# Altium project BoDieuKhienSoXuLyAmThanh.PrjPcb
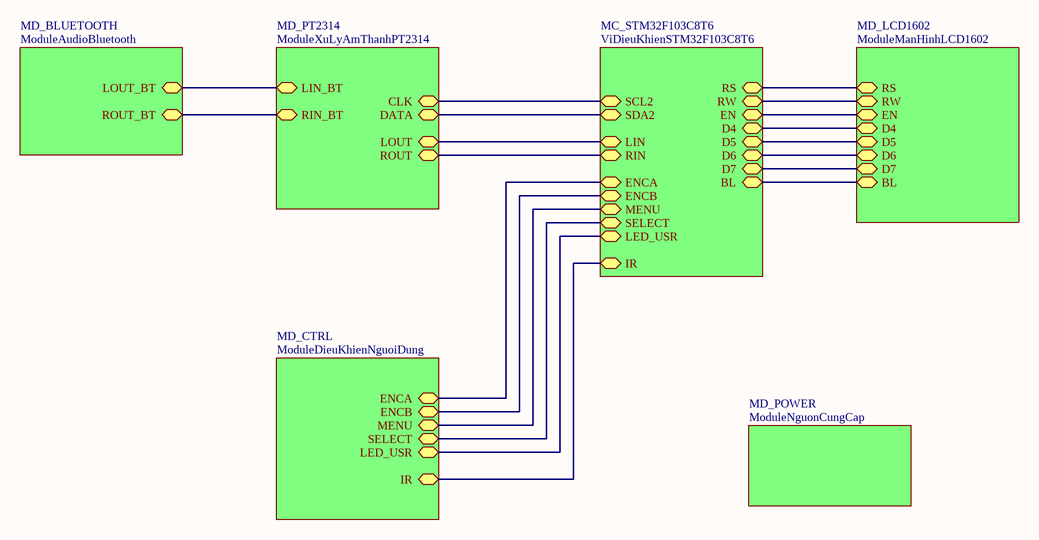
[diagram p0: BoDieuKhienSoXuLyAmThanh.SchDoc]
7 sheets, 100 parts. Net scope: hierarchical (ports join the sheet entries above them; power ports are global).
Board file: BoDieuKhienSoXuLyAmThanh.PcbDoc
Sheets:
  BoDieuKhienSoXuLyAmThanh.SchDoc
    MD_PT2314 = ModuleXuLyAmThanhPT2314.SchDoc
    MC_STM32F103C8T6 = ViDieuKhienSTM32F103C8T6.SchDoc
    MD_LCD1602 = ModuleManHinhLCD1602.SchDoc
    MD_POWER = ModuleNguonCungCap.SchDoc
    MD_CTRL = ModuleDieuKhienNguoiDung.SchDoc
    MD_BLUETOOTH = ModuleAudioBluetooth.SchDoc

## Sheet BoDieuKhienSoXuLyAmThanh.SchDoc
size A

### Sub-sheets
MC_STM32F103C8T6 = ViDieuKhienSTM32F103C8T6: RS (bidir), RW (bidir), EN (bidir), D4 (bidir), D5 (bidir), D6 (bidir), D7 (bidir), BL (bidir), IR (bidir), SCL2 (bidir), SDA2 (bidir), ENCA (bidir), ENCB (bidir), MENU (bidir), SELECT (bidir), LIN (bidir), RIN (bidir), LED_USR (bidir)
MD_BLUETOOTH = ModuleAudioBluetooth: LOUT_BT (bidir), ROUT_BT (bidir)
MD_CTRL = ModuleDieuKhienNguoiDung: ENCA (bidir), ENCB (bidir), MENU (bidir), SELECT (bidir), IR (bidir), LED_USR (bidir)
MD_LCD1602 = ModuleManHinhLCD1602: RS (bidir), RW (bidir), EN (bidir), D4 (bidir), D5 (bidir), D6 (bidir), D7 (bidir), BL (bidir)
MD_POWER = ModuleNguonCungCap: no entries
MD_PT2314 = ModuleXuLyAmThanhPT2314: LOUT (bidir), ROUT (bidir), DATA (bidir), CLK (bidir), LIN_BT (bidir), RIN_BT (bidir)

### Nets
LOUT: sheet MD_PT2314/LOUT, sheet MC_STM32F103C8T6/LIN
PA3: sheet MC_STM32F103C8T6/LED_USR, sheet MD_CTRL/LED_USR
PA12: sheet MC_STM32F103C8T6/BL, sheet MD_LCD1602/BL
ROUT: sheet MD_PT2314/ROUT, sheet MC_STM32F103C8T6/RIN
NetC18_1: sheet MD_PT2314/LIN_BT, sheet MD_BLUETOOTH/LOUT_BT
NetC20_1: sheet MD_PT2314/RIN_BT, sheet MD_BLUETOOTH/ROUT_BT
NetC32_1: sheet MC_STM32F103C8T6/ENCA, sheet MD_CTRL/ENCA
NetC33_1: sheet MC_STM32F103C8T6/ENCB, sheet MD_CTRL/ENCB
NetC34_1: sheet MC_STM32F103C8T6/SELECT, sheet MD_CTRL/SELECT
NetC35_1: sheet MC_STM32F103C8T6/MENU, sheet MD_CTRL/MENU
NetHR1_1: sheet MC_STM32F103C8T6/IR, sheet MD_CTRL/IR
NetMD2_4: sheet MC_STM32F103C8T6/RS, sheet MD_LCD1602/RS
NetMD2_5: sheet MC_STM32F103C8T6/RW, sheet MD_LCD1602/RW
NetMD2_6: sheet MC_STM32F103C8T6/EN, sheet MD_LCD1602/EN
NetMD2_11: sheet MC_STM32F103C8T6/D4, sheet MD_LCD1602/D4
NetMD2_12: sheet MC_STM32F103C8T6/D5, sheet MD_LCD1602/D5
NetMD2_13: sheet MC_STM32F103C8T6/D6, sheet MD_LCD1602/D6
NetMD2_14: sheet MC_STM32F103C8T6/D7, sheet MD_LCD1602/D7
NetR12_1: sheet MD_PT2314/CLK, sheet MC_STM32F103C8T6/SCL2
NetR13_1: sheet MD_PT2314/DATA, sheet MC_STM32F103C8T6/SDA2

## Sheet ModuleXuLyAmThanhPT2314.SchDoc
size A
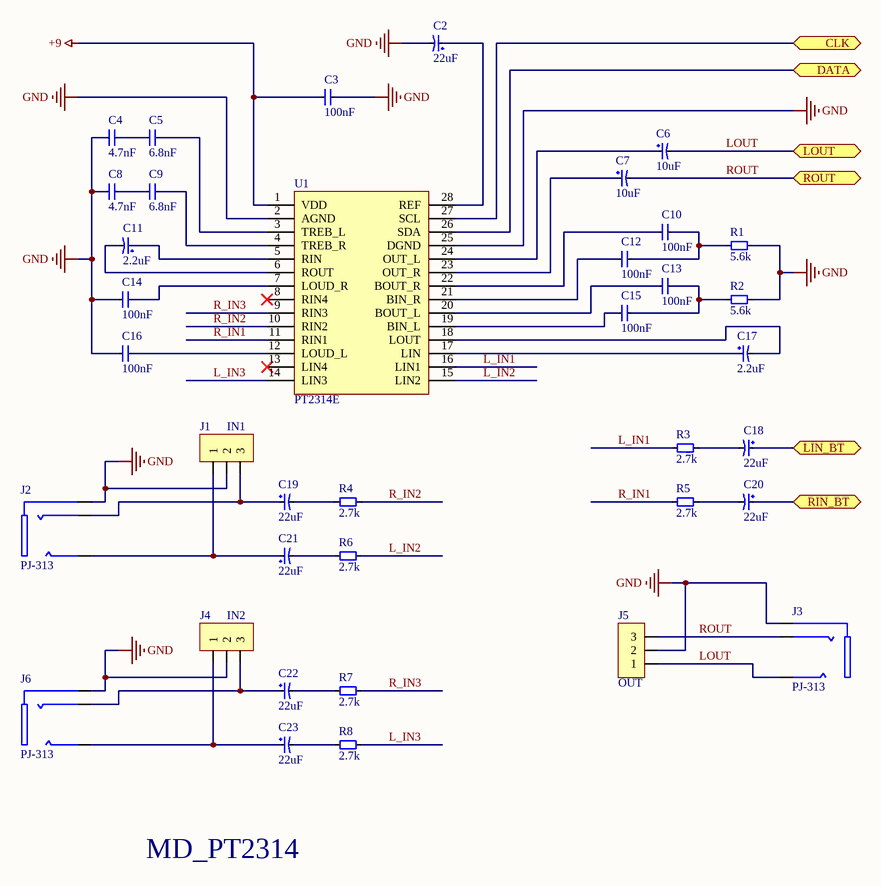
[diagram p1: ModuleXuLyAmThanhPT2314.SchDoc]

### Parts
C2  22uF  [C-ELE-1.5-4X7MM]
C3  100nF  [C-0805]
C4  4.7nF  [C-0805]
C5  6.8nF  [C-0805]
C6  10uF  [C-ELE-1.5-4X7MM]
C7  10uF  [C-ELE-1.5-4X7MM]
C8  4.7nF  [C-0805]
C9  6.8nF  [C-0805]
C10  100nF  [C-0805]
C11  2.2uF  [C-ELE-1.5-4X7MM]
C12  100nF  [C-0805]
C13  100nF  [C-0805]
C14  100nF  [C-0805]
C15  100nF  [C-0805]
C16  100nF  [C-0805]
C17  2.2uF  [C-ELE-1.5-4X7MM]
C18  22uF  [C-ELE-1.5-4X7MM]
C19  22uF  [C-ELE-1.5-4X7MM]
C20  22uF  [C-ELE-1.5-4X7MM]
C21  22uF  [C-ELE-1.5-4X7MM]
C22  22uF  [C-ELE-1.5-4X7MM]
C23  22uF  [C-ELE-1.5-4X7MM]
J1  IN1  [XH1X3M-2.54]
J2  PJ-313  [PJ-313]
J3  PJ-313  [PJ-313]
J4  IN2  [XH1X3M-2.54]
J5  OUT  [XH1X3M-2.54]
J6  PJ-313  [PJ-313]
R1  5.6k  [R-0805]
R2  5.6k  [R-0805]
R3  2.7k  [R-0805]
R4  2.7k  [R-0805]
R5  2.7k  [R-0805]
R6  2.7k  [R-0805]
R7  2.7k  [R-0805]
R8  2.7k  [R-0805]
U1  PT2314E  [SO28W-1.27-300MIL]

### Ports
CLK (bidir), DATA (bidir), LIN_BT (bidir), LOUT (bidir), RIN_BT (bidir), ROUT (bidir)

### Nets
+9: C3.1 U1.1(VDD)
GND: C2.2 C3.2 C4.1 C8.1 C14.1 C16.1 J1.2 J2.1 J3.1 J4.2 J5.2 J6.1 R1.2 R2.2 U1.2(AGND) U1.25(DGND)
L_IN1: R3.2 U1.16(LIN1)
L_IN2: R6.2 U1.15(LIN2)
L_IN3: R8.2 U1.14(LIN3)
LOUT: C6.2 J3.3 J5.1 ; port LOUT
R_IN1: R5.1 U1.11(RIN1)
R_IN2: R4.1 U1.10(RIN2)
R_IN3: R7.1 U1.9(RIN3)
ROUT: C7.2 J3.2 J5.3 ; port ROUT
NetC2_1: C2.1 U1.28(REF)
NetC4_2: C4.2 C5.1
NetC5_2: C5.2 U1.3(TREB_L)
NetC6_1: C6.1 U1.24(OUT_L)
NetC7_1: C7.1 U1.23(OUT_R)
NetC8_2: C8.2 C9.1
NetC9_2: C9.2 U1.4(TREB_R)
NetC10_1: C10.1 U1.22(BOUT_R)
NetC10_2: C10.2 C12.2 R1.1
NetC11_1: C11.1 U1.5(RIN)
NetC11_2: C11.2 U1.6(ROUT)
NetC12_1: C12.1 U1.21(BIN_R)
NetC13_1: C13.1 U1.20(BOUT_L)
NetC13_2: C13.2 C15.2 R2.1
NetC14_2: C14.2 U1.7(LOUD_R)
NetC15_1: C15.1 U1.19(BIN_L)
NetC16_2: C16.2 U1.12(LOUD_L)
NetC17_1: C17.1 U1.17(LIN)
NetC17_2: C17.2 U1.18(LOUT)
NetC18_1: C18.1 ; port LIN_BT
NetC18_2: C18.2 R3.1
NetC19_1: C19.1 J1.3 J2.2
NetC19_2: C19.2 R4.2
NetC20_1: C20.1 ; port RIN_BT
NetC20_2: C20.2 R5.2
NetC21_1: C21.1 J1.1 J2.3
NetC21_2: C21.2 R6.1
NetC22_1: C22.1 J4.3 J6.2
NetC22_2: C22.2 R7.2
NetC23_1: C23.1 J4.1 J6.3
NetC23_2: C23.2 R8.1
NetR12_1: U1.27(SCL) ; port CLK
NetR13_1: U1.26(SDA) ; port DATA

Not connected (* = marked no-connect by the designer): U1 8(RIN4)* 13(LIN4)*

### Notes on the sheet
- MD_PT2314

### Library data of the parts
C2 C6 C7 C11 C17-C23 = CAP-ELE: Cac Loai Tu Hoa
C3-C5 C8-C10 C12-C16 = CAP: Cac Loai Tu Khong Phan Cuc
J1 J4 J5 = XH1X3-2.54: Header 3 Chan XH 2.54mm
J2 J3 J6 = PJ-313: Jack Ket Noi Audio 3.5MM
R1-R8 = RES: Cac Loai Dien Tro
U1 = PT2314E: IC Xu Ly Am Thanh So

## Sheet ViDieuKhienSTM32F103C8T6.SchDoc
size A
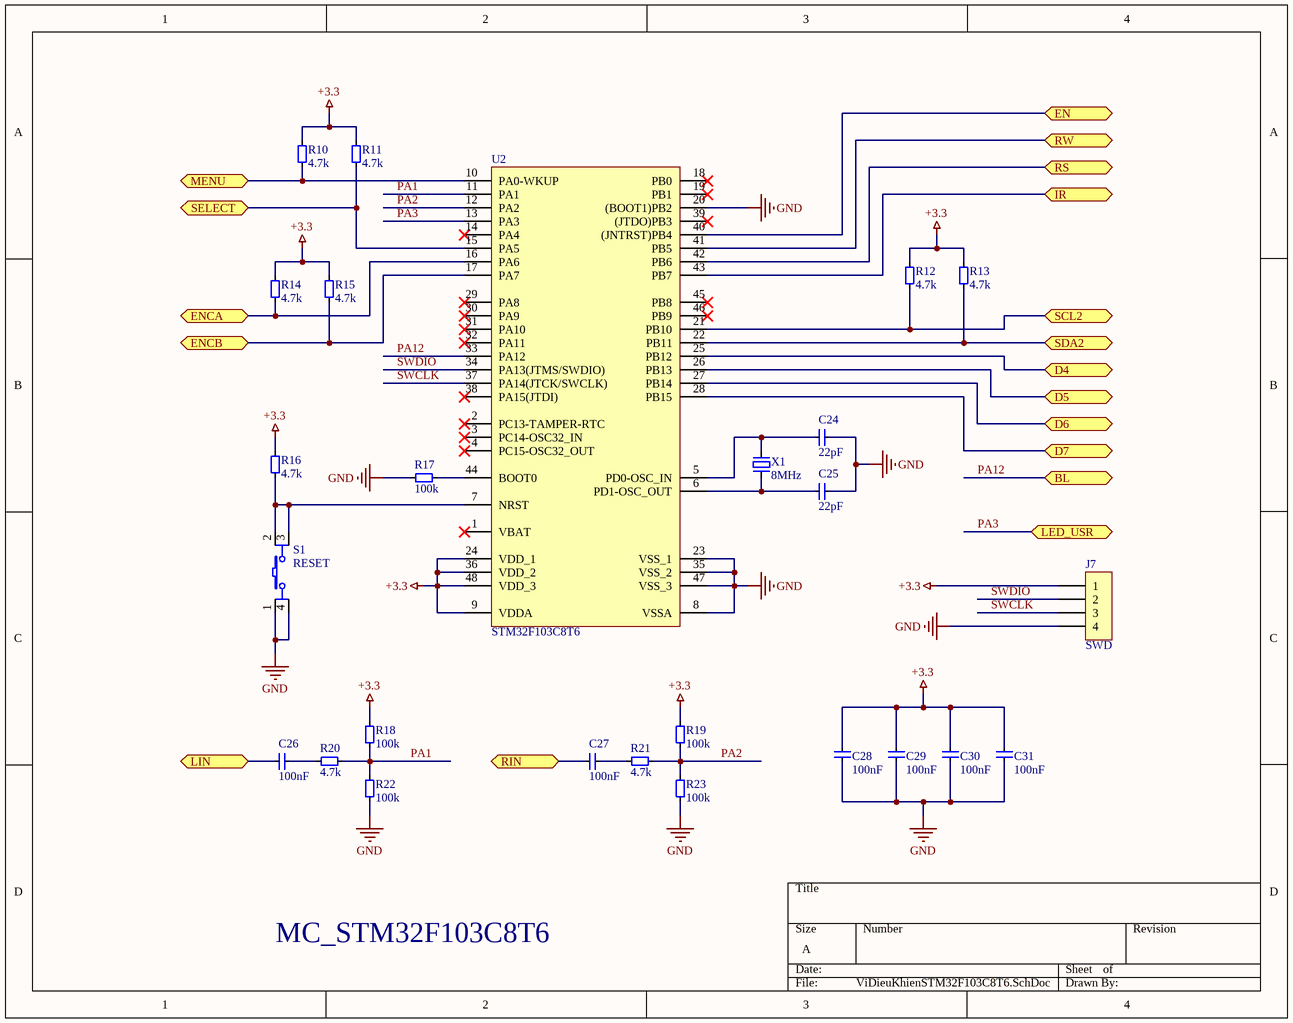
[diagram p2: ViDieuKhienSTM32F103C8T6.SchDoc]

### Parts
C24  22pF  [C-0805]
C25  22pF  [C-0805]
C26  100nF  [C-0805]
C27  100nF  [C-0805]
C28  100nF  [C-0805]
C29  100nF  [C-0805]
C30  100nF  [C-0805]
C31  100nF  [C-0805]
J7  SWD  [JP1X4M-2.54]
R10  4.7k  [R-0805]
R11  4.7k  [R-0805]
R12  4.7k  [R-0805]
R13  4.7k  [R-0805]
R14  4.7k  [R-0805]
R15  4.7k  [R-0805]
R16  4.7k  [R-0805]
R17  100k  [R-0805]
R18  100k  [R-0805]
R19  100k  [R-0805]
R20  4.7k  [R-0805]
R21  4.7k  [R-0805]
R22  100k  [R-0805]
R23  100k  [R-0805]
S1  RESET  [SW4P-DIP-6X6MM]
U2  STM32F103C8T6  [LQFP48-0.5-7X7MM]
X1  8MHz  [XTAL-HC49US]

### Ports
BL (bidir), D4 (bidir), D5 (bidir), D6 (bidir), D7 (bidir), EN (bidir), ENCA (bidir), ENCB (bidir), IR (bidir), LED_USR (bidir), LIN (bidir), MENU (bidir), RIN (bidir), RS (bidir), RW (bidir), SCL2 (bidir), SDA2 (bidir), SELECT (bidir)

### Nets
+3.3: C28.1 C29.1 C30.1 C31.1 J7.1 R10.2 R11.2 R12.2 R13.2 R14.2 R15.2 R16.2 R18.2 R19.2 U2.9(VDDA) U2.24(VDD_1) U2.36(VDD_2) U2.48(VDD_3)
GND: C24.1 C25.1 C28.2 C29.2 C30.2 C31.2 J7.4 R17.1 R22.1 R23.1 S1.1 S1.4 U2.8(VSSA) U2.20((BOOT1)PB2) U2.23(VSS_1) U2.35(VSS_2) U2.47(VSS_3)
LOUT: C26.2 ; port LIN
PA1: R18.1 R20.1 R22.2 U2.11(PA1)
PA2: R19.1 R21.1 R23.2 U2.12(PA2)
PA3: U2.13(PA3) ; port LED_USR
PA12: U2.33(PA12) ; port BL
ROUT: C27.2 ; port RIN
SWCLK: J7.3 U2.37(PA14(JTCK/SWCLK))
SWDIO: J7.2 U2.34(PA13(JTMS/SWDIO))
NetC24_2: C24.2 U2.5(PD0-OSC_IN) X1.1
NetC25_2: C25.2 U2.6(PD1-OSC_OUT) X1.2
NetC26_1: C26.1 R20.2
NetC27_1: C27.1 R21.2
NetC32_1: R14.1 U2.16(PA6) ; port ENCA
NetC33_1: R15.1 U2.17(PA7) ; port ENCB
NetC34_1: R11.1 U2.15(PA5) ; port SELECT
NetC35_1: R10.1 U2.10(PA0-WKUP) ; port MENU
NetHR1_1: U2.43(PB7) ; port IR
NetMD2_4: U2.42(PB6) ; port RS
NetMD2_5: U2.41(PB5) ; port RW
NetMD2_6: U2.40((JNTRST)PB4) ; port EN
NetMD2_11: U2.25(PB12) ; port D4
NetMD2_12: U2.26(PB13) ; port D5
NetMD2_13: U2.27(PB14) ; port D6
NetMD2_14: U2.28(PB15) ; port D7
NetR12_1: R12.1 U2.21(PB10) ; port SCL2
NetR13_1: R13.1 U2.22(PB11) ; port SDA2
NetR16_1: R16.1 S1.2 S1.3 U2.7(NRST)
NetR17_2: R17.2 U2.44(BOOT0)

Not connected (* = marked no-connect by the designer): U2 1(VBAT)* 2(PC13-TAMPER-RTC)* 3(PC14-OSC32_IN)* 4(PC15-OSC32_OUT)* 14(PA4)* 18(PB0)* 19(PB1)* 29(PA8)* 30(PA9)* 31(PA10)* 32(PA11)* 38(PA15(JTDI))* 39((JTDO)PB3)* 45(PB8)* 46(PB9)*

### Notes on the sheet
- MC_STM32F103C8T6

### Library data of the parts
C24-C31 = CAP: Cac Loai Tu Khong Phan Cuc
J7 = JP1X4-2.54: Jump Don 4 Chan 2.54mm
R10-R23 = RES: Cac Loai Dien Tro
S1 = SW4P-DIP-6X6MM: Nut Nhan 4 Chan 6X6MM
U2 = STM32F103C8T6: VDK 32-Bit ARM Cortex-M3
X1 = XTAL-HC49: Thach Anh 2 Chan HC49

## Sheet ModuleManHinhLCD1602.SchDoc
size A
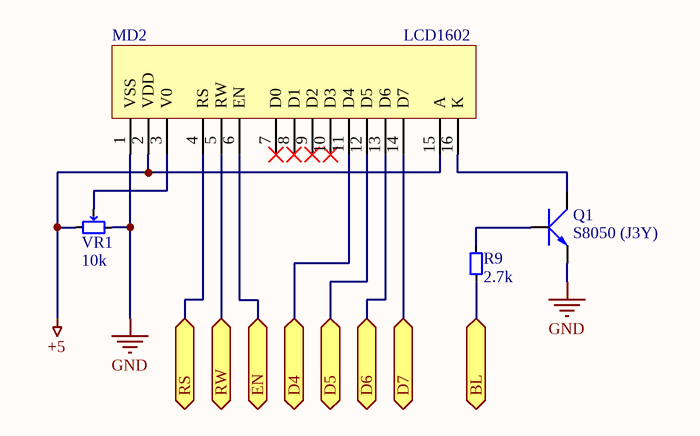
[diagram p3: ModuleManHinhLCD1602.SchDoc]

### Parts
MD2  LCD1602  [LCD1602-A]
Q1  S8050 (J3Y)  [SOT23]
R9  2.7k  [R-0805]
VR1  10k  [VR-ADJ-3362P]

### Ports
BL (bidir), D4 (bidir), D5 (bidir), D6 (bidir), D7 (bidir), EN (bidir), RS (bidir), RW (bidir)

### Nets
+5: MD2.2(VDD) MD2.15(A) VR1.3
GND: MD2.1(VSS) Q1.2(E) VR1.1
PA12: R9.1 ; port BL
NetMD2_3: MD2.3(V0) VR1.2
NetMD2_4: MD2.4(RS) ; port RS
NetMD2_5: MD2.5(RW) ; port RW
NetMD2_6: MD2.6(EN) ; port EN
NetMD2_11: MD2.11(D4) ; port D4
NetMD2_12: MD2.12(D5) ; port D5
NetMD2_13: MD2.13(D6) ; port D6
NetMD2_14: MD2.14(D7) ; port D7
NetMD2_16: MD2.16(K) Q1.3(C)
NetQ1_1: Q1.1(B) R9.2

Not connected (* = marked no-connect by the designer): MD2 7(D0)* 8(D1)* 9(D2)* 10(D3)*

### Library data of the parts
MD2 = LCD1602: Module Man Hinh LCD1602
Q1 = S8050 (J3Y): Transistor NPN 0.5A
R9 = RES: Cac Loai Dien Tro
VR1 = VRES: Cac Loai Bien Tro

## Sheet ModuleNguonCungCap.SchDoc
size A
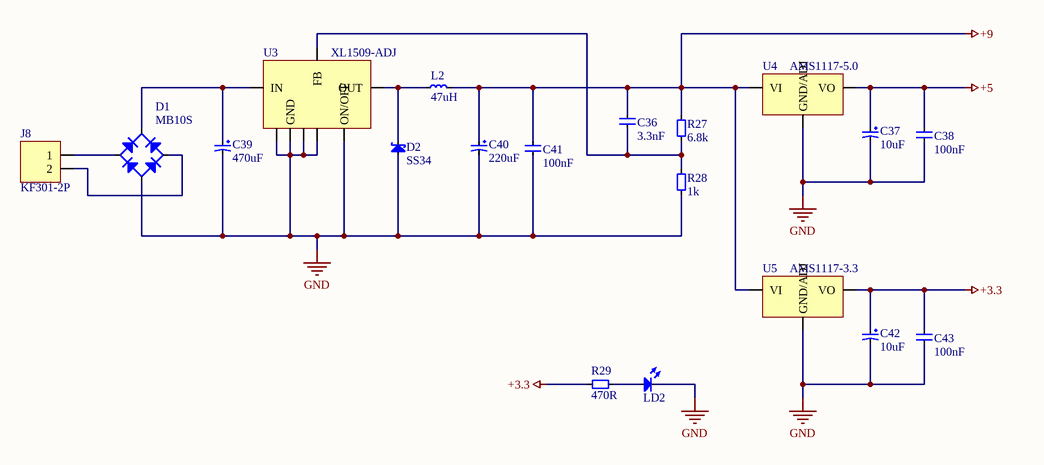
[diagram p4: ModuleNguonCungCap.SchDoc]

### Parts
C36  3.3nF  [C-0805]
C37  10uF  [C-ELE-1.5-4X7MM]
C38  100nF  [C-0805]
C39  470uF  [C-ELE-2.5-6.3X11MM]
C40  220uF  [C-ELE-2.5-6.3X11MM]
C41  100nF  [C-0805]
C42  10uF  [C-ELE-1.5-4X7MM]
C43  100nF  [C-0805]
D1  MB10S  [BRIDGE-MBS]
D2  SS34  [DO-214AC-SMA]
J8  KF301-2P  [KF301-2P-5.0]
L2  47uH  [L-PK0608-2.5-7X10MM]
LD2  PWR  [LED-0805-RED]  (value not drawn)
R27  6.8k  [R-0805]
R28  1k  [R-0805]
R29  470R  [R-0805]
U3  XL1509-ADJ  [SO8-1.27-150MIL]
U4  AMS1117-5.0  [SOT223]
U5  AMS1117-3.3  [SOT223]

### Nets
+3.3: C42.1 C43.2 R29.1 U5.2(VO)
+5: C37.1 C38.2 U4.2(VO)
+9: C36.2 C40.1 C41.2 L2.2 R27.2 U4.3(VI) U5.3(VI)
GND: C37.2 C38.1 C39.2 C40.2 C41.1 C42.2 C43.1 D1.DC- D2.1 LD2.2 R28.1 U3.4(ON/OFF) U3.5(GND) U3.6(GND) U3.7(GND) U3.8(GND) U4.1(GND/ADJ) U5.1(GND/ADJ)
NetC36_1: C36.1 R27.1 R28.2 U3.3(FB)
NetC39_1: C39.1 D1.DC+ U3.1(IN)
NetD1_AC1: D1.AC1 J8.1
NetD1_AC2: D1.AC2 J8.2
NetD2_2: D2.2 L2.1 U3.2(OUT)
NetLD2_1: LD2.1 R29.2

### Library data of the parts
C36 C38 C41 C43 = CAP: Cac Loai Tu Khong Phan Cuc
C37 C39 C40 C42 = CAP-ELE: Cac Loai Tu Hoa
D1 = BRIDGE: Cac Loai Diode Cau
D2 = SS34: Diode Schottky 1N5822 3A 40V Dan
J8 = KF301-2P: Dau Ket Noi KF301 2 Chan
L2 = IND: Cac Loai Cuon Cam Don
LD2 = LED: Cac Loai LED Don
R27-R29 = RES: Cac Loai Dien Tro
U3 = XL1509: IC On Ap Chuyen Mach 2A
U4 U5 = AMS1117: IC On Ap Tuyen Tinh AMS1117 1A

## Sheet ModuleDieuKhienNguoiDung.SchDoc
size A
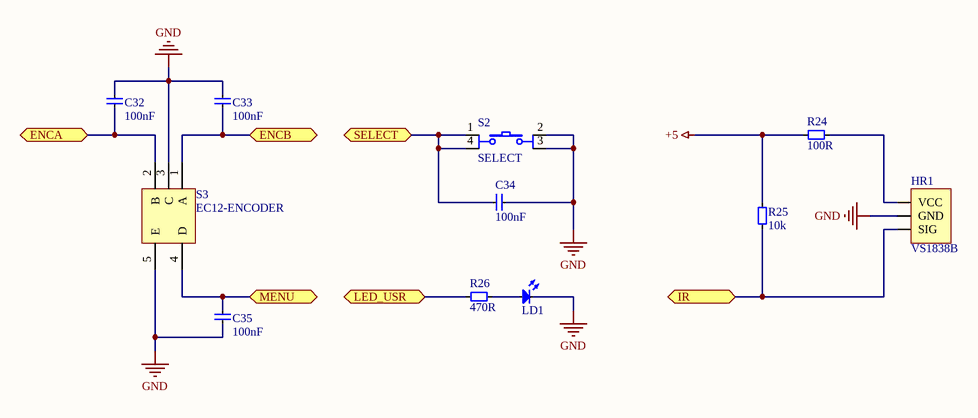
[diagram p5: ModuleDieuKhienNguoiDung.SchDoc]

### Parts
C32  100nF  [C-0805]
C33  100nF  [C-0805]
C34  100nF  [C-0805]
C35  100nF  [C-0805]
HR1  VS1838B  [VS1838B-A]
LD1  USR  [LED-0805-RED]  (value not drawn)
R24  100R  [R-0805]
R25  10k  [R-0805]
R26  470R  [R-0805]
S2  SELECT  [SW4P-DIP-6X6MM]
S3  EC12-ENCODER  [EC12-ENCODER]

### Ports
ENCA (bidir), ENCB (bidir), IR (bidir), LED_USR (bidir), MENU (bidir), SELECT (bidir)

### Nets
+5: R24.2 R25.2
GND: C32.2 C33.2 C34.2 C35.2 HR1.2(GND) LD1.2 S2.2 S2.3 S3.3(C) S3.5(E)
PA3: R26.1 ; port LED_USR
NetC32_1: C32.1 S3.2(B) ; port ENCA
NetC33_1: C33.1 S3.1(A) ; port ENCB
NetC34_1: C34.1 S2.1 S2.4 ; port SELECT
NetC35_1: C35.1 S3.4(D) ; port MENU
NetHR1_1: HR1.1(SIG) R25.1 ; port IR
NetHR1_3: HR1.3(VCC) R24.1
NetLD1_1: LD1.1 R26.2

### Library data of the parts
C32-C35 = CAP: Cac Loai Tu Khong Phan Cuc
HR1 = VS1838B: Module Giai Ma IR
LD1 = LED: Cac Loai LED Don
R24-R26 = RES: Cac Loai Dien Tro
S2 = SW4P-DIP-6X6MM: Nut Nhan 4 Chan 6X6MM
S3 = EC12-ENCODER: Encoder Xoay Vo Cap Co Nut Nhan

## Sheet ModuleAudioBluetooth.SchDoc
size A
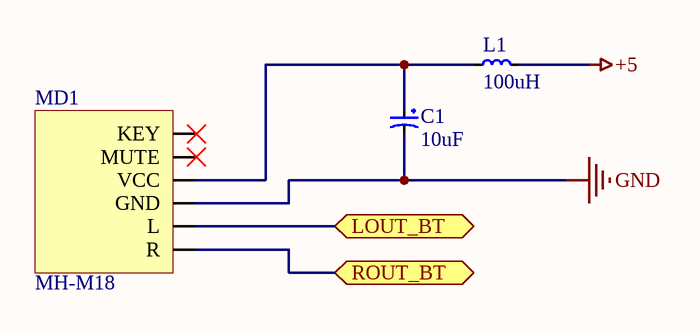
[diagram p6: ModuleAudioBluetooth.SchDoc]

### Parts
C1  10uF  [C-ELE-1.5-4X7MM]
L1  100uH  [L-PK0406-2-5X8MM]
MD1  MH-M18  [MH-M18]

### Ports
LOUT_BT (bidir), ROUT_BT (bidir)

### Nets
+5: L1.2
GND: C1.2 MD1.4(GND)
NetC1_1: C1.1 L1.1 MD1.3(VCC)
NetC18_1: MD1.5(L) ; port LOUT_BT
NetC20_1: MD1.6(R) ; port ROUT_BT

Not connected (* = marked no-connect by the designer): MD1 1(KEY)* 2(MUTE)*

### Library data of the parts
C1 = CAP-ELE: Cac Loai Tu Hoa
L1 = IND: Cac Loai Cuon Cam Don
MD1 = MH-M18: Module Thu Audio Bluetooth

## Nets that join several sheets
+3.3: ViDieuKhienSTM32F103C8T6 (18 pins), ModuleNguonCungCap (C42.1 C43.2 R29.1 U5.2)
+5: ModuleManHinhLCD1602 (MD2.2 MD2.15 VR1.3), ModuleNguonCungCap (C37.1 C38.2 U4.2), ModuleDieuKhienNguoiDung (R24.2 R25.2), ModuleAudioBluetooth (L1.2)
+9: ModuleXuLyAmThanhPT2314 (C3.1 U1.1), ModuleNguonCungCap (7 pins)
GND: ModuleXuLyAmThanhPT2314 (16 pins), ViDieuKhienSTM32F103C8T6 (17 pins), ModuleManHinhLCD1602 (MD2.1 Q1.2 VR1.1), ModuleNguonCungCap (18 pins), ModuleDieuKhienNguoiDung (10 pins), ModuleAudioBluetooth (C1.2 MD1.4)
LOUT: ModuleXuLyAmThanhPT2314 (C6.2 J3.3 J5.1), ViDieuKhienSTM32F103C8T6 (C26.2)
NetC18_1: ModuleXuLyAmThanhPT2314 (C18.1), ModuleAudioBluetooth (MD1.5)
NetC20_1: ModuleXuLyAmThanhPT2314 (C20.1), ModuleAudioBluetooth (MD1.6)
NetC32_1: ViDieuKhienSTM32F103C8T6 (R14.1 U2.16), ModuleDieuKhienNguoiDung (C32.1 S3.2)
NetC33_1: ViDieuKhienSTM32F103C8T6 (R15.1 U2.17), ModuleDieuKhienNguoiDung (C33.1 S3.1)
NetC34_1: ViDieuKhienSTM32F103C8T6 (R11.1 U2.15), ModuleDieuKhienNguoiDung (C34.1 S2.1 S2.4)
NetC35_1: ViDieuKhienSTM32F103C8T6 (R10.1 U2.10), ModuleDieuKhienNguoiDung (C35.1 S3.4)
NetHR1_1: ViDieuKhienSTM32F103C8T6 (U2.43), ModuleDieuKhienNguoiDung (HR1.1 R25.1)
NetMD2_4: ViDieuKhienSTM32F103C8T6 (U2.42), ModuleManHinhLCD1602 (MD2.4)
NetMD2_5: ViDieuKhienSTM32F103C8T6 (U2.41), ModuleManHinhLCD1602 (MD2.5)
NetMD2_6: ViDieuKhienSTM32F103C8T6 (U2.40), ModuleManHinhLCD1602 (MD2.6)
NetMD2_11: ViDieuKhienSTM32F103C8T6 (U2.25), ModuleManHinhLCD1602 (MD2.11)
NetMD2_12: ViDieuKhienSTM32F103C8T6 (U2.26), ModuleManHinhLCD1602 (MD2.12)
NetMD2_13: ViDieuKhienSTM32F103C8T6 (U2.27), ModuleManHinhLCD1602 (MD2.13)
NetMD2_14: ViDieuKhienSTM32F103C8T6 (U2.28), ModuleManHinhLCD1602 (MD2.14)
NetR12_1: ModuleXuLyAmThanhPT2314 (U1.27), ViDieuKhienSTM32F103C8T6 (R12.1 U2.21)
NetR13_1: ModuleXuLyAmThanhPT2314 (U1.26), ViDieuKhienSTM32F103C8T6 (R13.1 U2.22)
PA3: ViDieuKhienSTM32F103C8T6 (U2.13), ModuleDieuKhienNguoiDung (R26.1)
PA12: ViDieuKhienSTM32F103C8T6 (U2.33), ModuleManHinhLCD1602 (R9.1)
ROUT: ModuleXuLyAmThanhPT2314 (C7.2 J3.2 J5.3), ViDieuKhienSTM32F103C8T6 (C27.2)